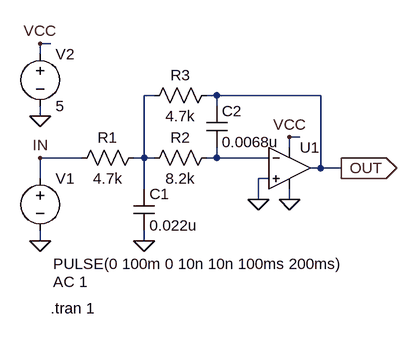
[diagram p0: schematic MIDI_CV_CONV_MFB_LPF.asc]
MIDI_CV_CONV_MFB_LPF.asc, the LTspice schematic file:
Version 4
SHEET 1 880 680
WIRE 32 -48 16 -48
WIRE 16 -32 16 -48
WIRE 192 32 176 32
WIRE 288 32 272 32
WIRE 448 32 288 32
WIRE 288 48 288 32
WIRE 16 64 16 48
WIRE 416 96 400 96
WIRE 400 112 400 96
WIRE 80 128 16 128
WIRE 176 128 176 32
WIRE 176 128 160 128
WIRE 192 128 176 128
WIRE 288 128 288 112
WIRE 288 128 272 128
WIRE 368 128 288 128
WIRE 448 144 448 32
WIRE 448 144 432 144
WIRE 480 144 448 144
WIRE 16 160 16 128
WIRE 368 160 352 160
WIRE 176 176 176 128
WIRE 352 192 352 160
WIRE 400 192 400 176
WIRE 16 256 16 240
WIRE 176 256 176 240
FLAG 352 192 0
FLAG 400 192 0
FLAG 400 96 VCC
FLAG 176 256 0
FLAG 16 256 0
FLAG 16 128 IN
FLAG 16 64 0
FLAG 16 -48 VCC
FLAG 480 144 OUT
IOPIN 480 144 Out
SYMBOL res 176 112 R90
WINDOW 0 0 56 VBottom 2
WINDOW 3 32 56 VTop 2
SYMATTR InstName R1
SYMATTR Value 4.7k
SYMBOL res 288 112 R90
WINDOW 0 0 56 VBottom 2
WINDOW 3 32 56 VTop 2
SYMATTR InstName R2
SYMATTR Value 8.2k
SYMBOL res 288 16 R90
WINDOW 0 0 56 VBottom 2
WINDOW 3 32 56 VTop 2
SYMATTR InstName R3
SYMATTR Value 4.7k
SYMBOL cap 160 176 R0
SYMATTR InstName C1
SYMATTR Value 0.022u
SYMBOL cap 272 48 R0
SYMATTR InstName C2
SYMATTR Value 0.0068u
SYMBOL Opamps\\UniversalOpamp2 400 144 R0
SYMATTR InstName U1
SYMBOL voltage 16 144 R0
WINDOW 3 20 147 Left 2
WINDOW 123 20 175 Left 2
WINDOW 39 0 0 Left 2
SYMATTR Value PULSE(0 100m 0 10n 10n 100ms 200ms)
SYMATTR Value2 AC 1
SYMATTR InstName V1
SYMBOL voltage 16 -48 R0
WINDOW 123 0 0 Left 2
WINDOW 39 0 0 Left 2
SYMATTR InstName V2
SYMATTR Value 5
TEXT 32 360 Left 2 !.tran 1

The netlist it stands for:
* MIDI_CV_CONV_MFB_LPF.asc
R1 N001 IN 4.7k
R2 N002 N001 8.2k
R3 OUT N001 4.7k
C1 N001 0 0.022u
C2 OUT N002 0.0068u
XU1 0 N002 VCC 0 OUT level.2 Avol=1Meg GBW=10Meg Slew=10Meg ilimit=25m rail=0 Vos=0 phimargin=45 en=0 enk=0 in=0 ink=0 Rin=500Meg  ; pins IN+ IN- V+ V- OUT
V1 IN 0 PULSE(0 100m 0 10n 10n 100ms 200ms) AC 1
V2 VCC 0 5
.tran 1
.lib UniversalOpamps2.sub
.backanno
.end